# Altium project PCB_Project_IGNIS_v2.PrjPcb
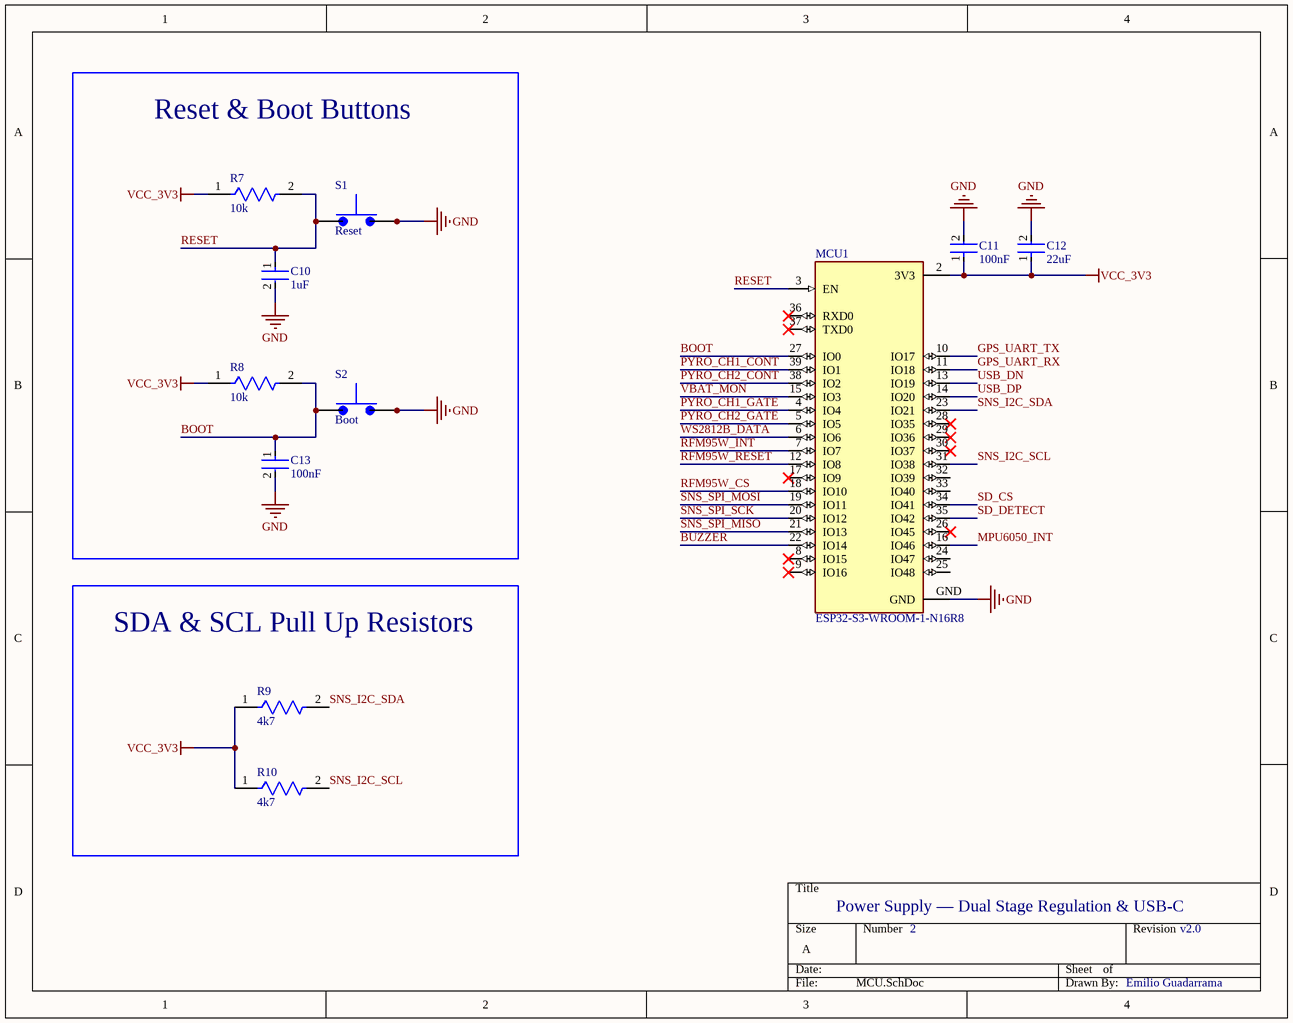
[diagram p0: MCU.SchDoc]
8 sheets, 58 parts. Net scope: flat (ports and power ports of the same name join across sheets).
Sheets:
  Main.SchDoc
  MCU.SchDoc
  Power.SchDoc
  RF_LoRa_&_GPS.SchDoc
  Sensors.SchDoc
  Storage.SchDoc
  Indicators.SchDoc
  Pyros.SchDoc

## Sheet Main.SchDoc
size A; SheetNumber: 1; SheetTotal: 8

## Sheet MCU.SchDoc
size A; SheetNumber: 2; SheetTotal: 8

### Parts
C10  1uF  [FP-C0805C-DN-MFG]
C11  100nF  [FP-C0805C-DN-MFG]
C12  22uF  [FP-C0805C-DN-MFG]
C13  100nF  [FP-C0805C-DN-MFG]
MCU1  ESP32-S3-WROOM-1-N16R8  [XCVR_ESP32-S3-WROOM-1-N16R2]
R7  10k  [FP-MCT0603-IPC_A]
R8  10k  [FP-MCT0603-IPC_A]
R9  4k7  [FP-MCT0603-IPC_A]
R10  4k7  [FP-MCT0603-IPC_A]
S1  Reset  [SW_SKRPABE010]
S2  Boot  [SW_SKRPABE010]

### Blocks framed on the sheet
Reset & Boot Buttons: C10 C13 R7 R8 S1 S2
SDA & SCL Pull Up Resistors: R9 R10

### Nets
GND: C10.2 C11.2 C12.2 C13.2 MCU1.GND S1.3 S1.4 S2.3 S2.4
VCC_3V3: C11.1 C12.1 MCU1.2(3V3) R7.1 R8.1 R9.1 R10.1
BOOT: C13.1 MCU1.27(IO0) R8.2 S2.1 S2.2
BUZZER: MCU1.22(IO14)
GPS_UART_RX: MCU1.11(IO18)
GPS_UART_TX: MCU1.10(IO17)
MPU6050_INT: MCU1.16(IO46)
PYRO_CH1_CONT: MCU1.39(IO1)
PYRO_CH1_GATE: MCU1.4(IO4)
PYRO_CH2_CONT: MCU1.38(IO2)
PYRO_CH2_GATE: MCU1.5(IO5)
RESET: C10.1 MCU1.3(EN) R7.2 S1.1 S1.2
RFM95W_CS: MCU1.18(IO10)
RFM95W_INT: MCU1.7(IO7)
RFM95W_RESET: MCU1.12(IO8)
SD_CS: MCU1.34(IO41)
SD_DETECT: MCU1.35(IO42)
SNS_I2C_SCL: MCU1.31(IO38) R10.2
SNS_I2C_SDA: MCU1.23(IO21) R9.2
SNS_SPI_MISO: MCU1.21(IO13)
SNS_SPI_MOSI: MCU1.19(IO11)
SNS_SPI_SCK: MCU1.20(IO12)
USB_DN: MCU1.13(IO19)
USB_DP: MCU1.14(IO20)
VBAT_MON: MCU1.15(IO3)
WS2812B_DATA: MCU1.6(IO6)

Not connected (* = marked no-connect by the designer): MCU1 8(IO15)* 9(IO16)* 17(IO9)* 24(IO47) 25(IO48) 26(IO45)* 28(IO35)* 29(IO36)* 30(IO37)* 32(IO39) 33(IO40) 36(RXD0)* 37(TXD0)*

### Notes on the sheet
- Power Supply — Dual Stage Regulation & USB-C
- 2
- v2.0
- Emilio Guadarrama

### Library data of the parts
C10-C13 = CMP-2007-00279-2: CAP CER 0.1UF 50V X7R 0805; Manufacturer Part Number: C0805C104K5RACTU; Manufacturer: KEMET; Value: 0.10 μF; Tolerance: 0.1; Temperature Coefficient: 30ppm/°C; Material: Ceramic; Device Class L2: Capacitors; Temperature Range Low: -55°C; Voltage Rating: 50 V; Digikey Description: CAP CER 0.1UF 50V X7R 0805; Category: Cap; ComponentLink2Description: Datasheet; Octopart: https://octopart.com/c0805c104k5ractu-kemet-143926; RoHS: TRUE; ComponentLink2URL: https://content.kemet.com/datasheets/KEM_C1003_C0G_SMD.pdf; Temperature Characteristic: X7R; Temperature: -55°C to +125°C; Height: 0.88mm; Temperature Range High: +125°C; Device Class L1: Passive Components; Automotive: No; Lead Free: Yes; Ipc Land Pattern Name: CAPC200125X78; Device Class L3: Ceramic Capacitors; Mouser Description: Cap Ceramic 0.1uF 50V X7R 10% SMD 2.0 x 1.2 mm 125 C Paper T/R; Capacitance: 0.10 μF; Package: C0805C-DN
MCU1 = ESP32-S3-WROOM-1-N16R2: Bluetooth, WiFi 802.11b/g/n, Bluetooth v5.0 Transceiver Module 2.4GHz PCB Trace Surface Mount; MF: Espressif Systems; MP: ESP32S3WROOM1N16R2; SnapEDA_Link: https://www.snapeda.com/parts/ESP32S3WROOM1N16R2/Espressif+Systems/view-part/?ref=snap; Package: NON STANDARD Espressif Systems; Value: *; Check_prices: https://www.snapeda.com/parts/ESP32S3WROOM1N16R2/Espressif+Systems/view-part/?ref=eda
R7-R10 = CMP-02407-011165-1: RES SMD 100 OHM 1% 1/8W 0603; Temperature Coefficient: 25ppm/°C; Resistance: 20kR; Power Rating: 125mW; Tolerance: 0.1%; Voltage Rating: 75V; Length: 1.55mm; Case Code (Imperial): 0603; Case/Package: 0603; Construction: Rectangular; Package Quantity: 1000; Number of Terminations: 2; Termination: SMD/SMT; Resistor Type: Thin Film; Features: Automotive AEC-Q200; Series: MCT 0603 - Precision; Max Operating Temperature: 155°C; Depth: 0.85mm; Max Power Dissipation: 125mW; Min Operating Temperature: -55°C; Width: 0.033inch; Case Code (Metric): 1608; Packaging: Tape and Reel; Weight: 6.7E-05oz; Military Standard: Not; Height: 0.022inch
S1 S2 = SKRPABE010: Switch Tactile N.O. SPST Button J-Bend 0.05A 16VDC 1.57N SMD Automotive T/R; MF: ALPS; SnapEDA_Link: https://www.snapeda.com/parts/SKRPABE010/ALPS/view-part/?ref=snap; Package: None; Value: *; MP: SKRPABE010; Check_prices: https://www.snapeda.com/parts/SKRPABE010/ALPS/view-part/?ref=eda

## Sheet Power.SchDoc
size A; SheetNumber: 3; SheetTotal: 8
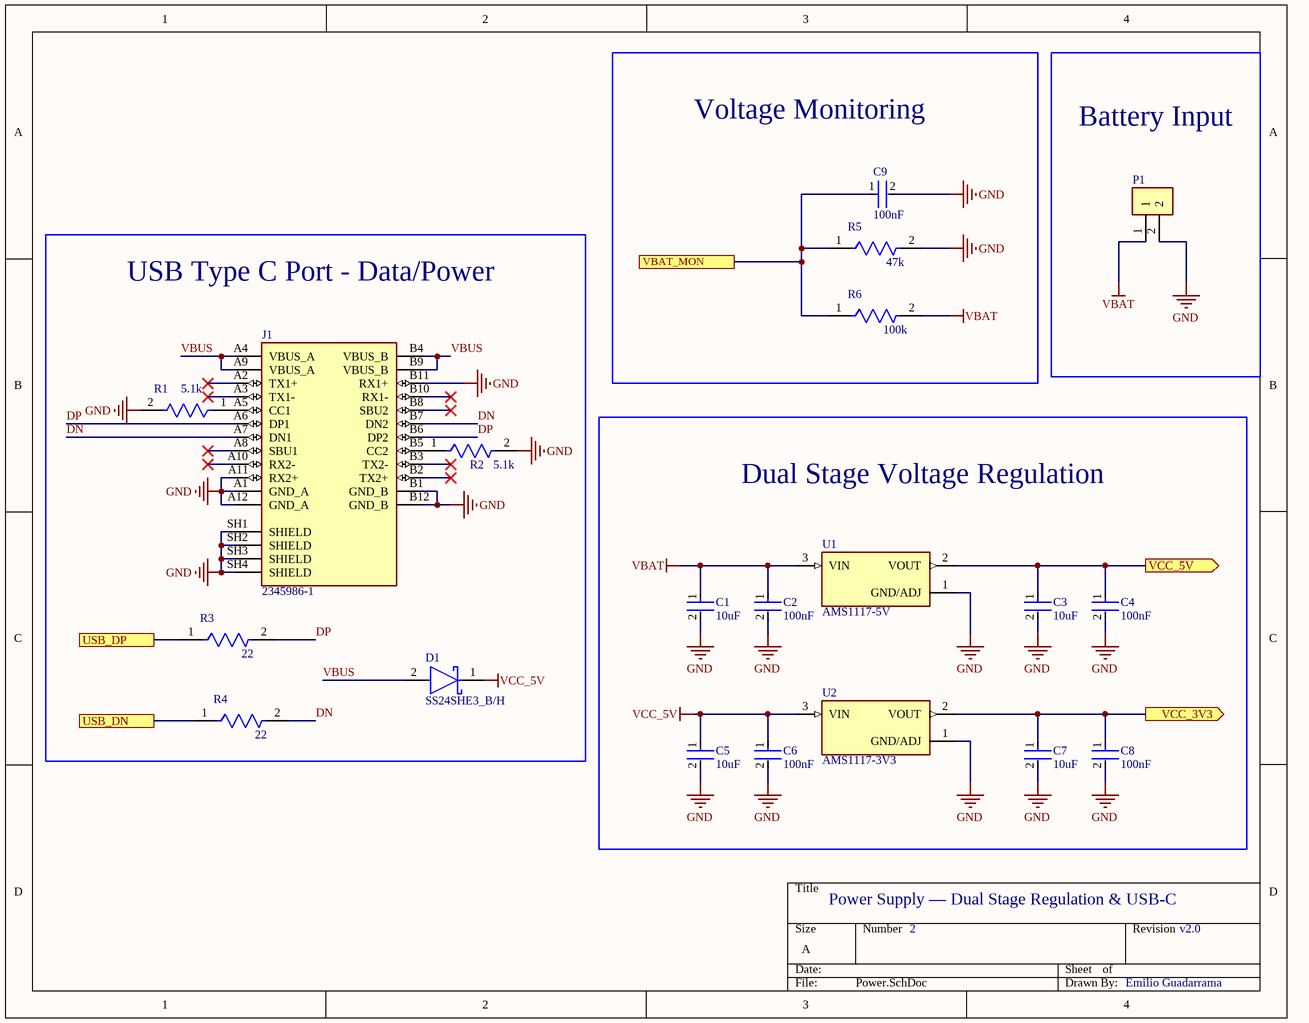
[diagram p1: Power.SchDoc]

### Parts
C1  10uF  [FP-C0805C-DN-MFG]
C2  100nF  [FP-C0805C-DN-MFG]
C3  10uF  [FP-C0805C-DN-MFG]
C4  100nF  [FP-C0805C-DN-MFG]
C5  10uF  [FP-C0805C-DN-MFG]
C6  100nF  [FP-C0805C-DN-MFG]
C7  10uF  [FP-C0805C-DN-MFG]
C8  100nF  [FP-C0805C-DN-MFG]
C9  100nF  [FP-C0805C-DN-MFG]
D1  SS24SHE3_B/H  [FP-95400-MFG]
J1  2345986-1  [TE_2345986-1]
P1  282837-2  [TE_282837-2]  (value not drawn)
R1  5.1k  [FP-MCT0603-IPC_A]
R2  5.1k  [FP-MCT0603-IPC_A]
R3  22  [FP-MCT0603-IPC_A]
R4  22  [FP-MCT0603-IPC_A]
R5  47k  [FP-MCT0603-IPC_A]
R6  100k  [FP-MCT0603-IPC_A]
U1  AMS1117-5V  [SOT229P700X180-4N]
U2  AMS1117-3V3  [SOT229P700X180-4N]

### Blocks framed on the sheet
Voltage Monitoring: C9 R5 R6
Battery Input: P1
Dual Stage Voltage Regulation: C1-C8 U1 U2

### Ports
USB_DN, USB_DP, VBAT_MON, VCC_3V3 (out), VCC_5V (out)

### Nets
GND: C1.2 C2.2 C3.2 C4.2 C5.2 C6.2 C7.2 C8.2 C9.2 J1.A1(GND_A) J1.A11(RX2+) J1.A12(GND_A) J1.B1(GND_B) J1.B11(RX1+) J1.B12(GND_B) J1.SH1(SHIELD) J1.SH2(SHIELD) J1.SH3(SHIELD) J1.SH4(SHIELD) P1.2 R1.2 R2.2 R5.2 U1.1(GND/ADJ) U2.1(GND/ADJ)
VBAT: C1.1 C2.1 P1.1 R6.2 U1.3(VIN)
VCC_5V: C5.1 C6.1 D1.1(C) U2.3(VIN)
DN: J1.A7(DN1) J1.B7(DN2) R4.2
DP: J1.A6(DP1) J1.B6(DP2) R3.2
VBUS: D1.2(A) J1.A4(VBUS_A) J1.A9(VBUS_A) J1.B4(VBUS_B) J1.B9(VBUS_B)
NetC3_1: C3.1 C4.1 U1.2(VOUT) ; port VCC_5V
NetC7_1: C7.1 C8.1 U2.2(VOUT) ; port VCC_3V3
NetC9_1: C9.1 R5.1 R6.1 ; port VBAT_MON
NetJ1_A5: J1.A5(CC1) R1.1
NetJ1_B5: J1.B5(CC2) R2.1
NetR3_1: R3.1 ; port USB_DP
NetR4_1: R4.1 ; port USB_DN

Not connected (* = marked no-connect by the designer): J1 A2(TX1+)* A3(TX1-)* A8(SBU1)* A10(RX2-)* B2(TX2+)* B3(TX2-)* B8(SBU2)* B10(RX1-)*

### Notes on the sheet
- USB Type C Port - Data/Power
- Power Supply — Dual Stage Regulation & USB-C
- 2
- v2.0
- Emilio Guadarrama

### Library data of the parts
C1-C9 = CMP-2007-00279-2: as C10 on sheet MCU; Device Class L2: Capacitors; Temperature Range Low: -55°C; Voltage Rating: 50 V; Digikey Description: CAP CER 0.1UF 50V X7R 0805; Category: Cap; ComponentLink2Description: Datasheet; Octopart: https://octopart.com/c0805c104k5ractu-kemet-143926; RoHS: TRUE; ComponentLink2URL: https://content.kemet.com/datasheets/KEM_C1003_C0G_SMD.pdf; Temperature Characteristic: X7R; Temperature: -55°C to +125°C; Height: 0.88mm; Temperature Range High: +125°C; Device Class L1: Passive Components; Automotive: No; Lead Free: Yes; Ipc Land Pattern Name: CAPC200125X78; Device Class L3: Ceramic Capacitors; Mouser Description: Cap Ceramic 0.1uF 50V X7R 10% SMD 2.0 x 1.2 mm 125 C Paper T/R; Capacitance: 0.10 μF; Package: C0805C-DN
D1 = CMP-02539-000047-1: DIODE SCHOTTKY 2A 40V DO-214AC; RoHS Compliant: Yes
P1 = 282837-2: Ð Ð°Ð·ÑŠÐµÐ¼Ð½Ñ‹Ðµ ÐºÐ»ÐµÐ¼Ð¼Ð½Ñ‹Ðµ ÐºÐ¾Ð»Ð¾Ð´ÐºÐ¸ Ð Ð¾Ð·ÐµÑ‚ÐºÐ° 2 Ð¿Ð¾Ð»Ð¾Ð¶ÐµÐ½Ð¸Ñ 5,08 Ð¼Ð¼ ÐŸÑ€Ð¸Ð¿Ð¾Ð¹ Ð¿Ñ€ÑÐ¼Ð¾Ð¹ Ñ‡ÐµÑ€ÐµÐ· Ð¾Ñ‚Ð²ÐµÑ€ÑÑ‚Ð¸Ðµ 13,5 Ð / ÐºÐ¾Ð½Ñ‚Ð°ÐºÑ‚; MF: TE Connectivity; SnapEDA_Link: https://www.snapeda.com/parts/282837-2/TE+Connectivity+AMP+Connectors/view-part/?ref=snap; Price: None; Check_prices: https://www.snapeda.com/parts/282837-2/TE+Connectivity+AMP+Connectors/view-part/?ref=eda; Purchase-URL: https://pricing.snapeda.com/search/part/282837-2/?ref=eda; MP: 282837-2; Value: *; Availability: In Stock; Package: None
R1-R6 = CMP-02407-011165-1: as R7 on sheet MCU; Length: 1.55mm; Case Code (Imperial): 0603; Case/Package: 0603; Construction: Rectangular; Package Quantity: 1000; Number of Terminations: 2; Termination: SMD/SMT; Resistor Type: Thin Film; Features: Automotive AEC-Q200; Series: MCT 0603 - Precision; Max Operating Temperature: 155°C; Depth: 0.85mm; Max Power Dissipation: 125mW; Min Operating Temperature: -55°C; Width: 0.033inch; Case Code (Metric): 1608; Packaging: Tape and Reel; Weight: 6.7E-05oz; Military Standard: Not; Height: 0.022inch
U1 U2 = AMS1117-5.0: 1A LOW DROPOUT VOLTAGE REGULATOR; MF: ams; MP: AMS1117-5.0; Package: SOT-223 Seeed Technology; SnapEDA_Link: https://www.snapeda.com/parts/AMS1117-5.0/ams/view-part/?ref=snap; Check_prices: https://www.snapeda.com/parts/AMS1117-5.0/ams/view-part/?ref=eda; Availability: Not in stock; Value: *; Price: None
J1 = 2345986-1: Package: None; Price: None; Value: *; MP: 2345986-1; Availability: Unavailable

## Sheet RF_LoRa_&_GPS.SchDoc
size A; SheetNumber: 4; SheetTotal: 8
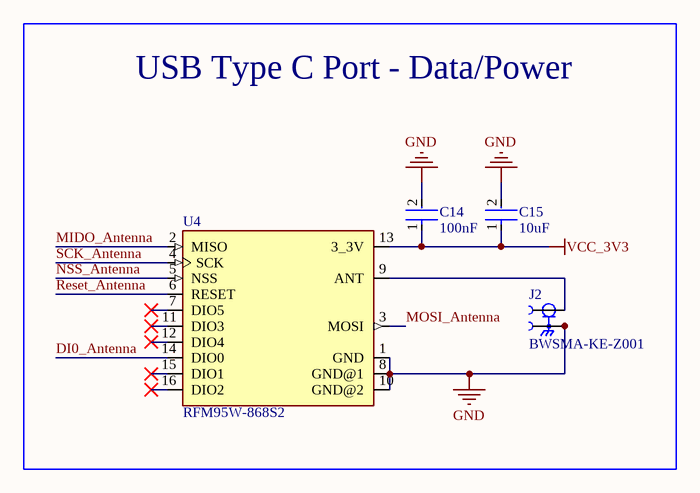
[diagram p2: RF_LoRa_&_GPS.SchDoc]

### Parts
C14  100nF  [FP-C0805C-DN-MFG]
C15  10uF  [FP-C0805C-DN-MFG]
J2  BWSMA-KE-Z001  [BAT_WIRELESS_BWSMA-KE-Z001]
U4  RFM95W-868S2  [XCVR_RFM95W-868S2]

### Nets
GND: C14.2 C15.2 J2.2_1 J2.2_2 J2.2_3 J2.2_4 U4.1(GND) U4.8(GND@1) U4.10(GND@2)
VCC_3V3: C14.1 C15.1 U4.13(3_3V)
DI0_Antenna: U4.14(DIO0)
MIDO_Antenna: U4.2(MISO)
MOSI_Antenna: U4.3(MOSI)
NSS_Antenna: U4.5(NSS)
Reset_Antenna: U4.6(RESET)
SCK_Antenna: U4.4(SCK)
NetJ2_1: J2.1 U4.9(ANT)

Not connected (* = marked no-connect by the designer): U4 7(DIO5)* 11(DIO3)* 12(DIO4)* 15(DIO1)* 16(DIO2)*

### Notes on the sheet
- USB Type C Port - Data/Power

### Library data of the parts
C14 C15 = CMP-2007-00279-2: as C10 on sheet MCU; Device Class L2: Capacitors; Temperature Range Low: -55°C; Voltage Rating: 50 V; Digikey Description: CAP CER 0.1UF 50V X7R 0805; Category: Cap; ComponentLink2Description: Datasheet; Octopart: https://octopart.com/c0805c104k5ractu-kemet-143926; RoHS: TRUE; ComponentLink2URL: https://content.kemet.com/datasheets/KEM_C1003_C0G_SMD.pdf; Temperature Characteristic: X7R; Temperature: -55°C to +125°C; Height: 0.88mm; Temperature Range High: +125°C; Device Class L1: Passive Components; Automotive: No; Lead Free: Yes; Ipc Land Pattern Name: CAPC200125X78; Device Class L3: Ceramic Capacitors; Mouser Description: Cap Ceramic 0.1uF 50V X7R 10% SMD 2.0 x 1.2 mm 125 C Paper T/R; Capacitance: 0.10 μF; Package: C0805C-DN
J2 = BWSMA-KE-Z001: 1 Inner bore SMA Board Edge Positive foot -65â„ƒ~+165â„ƒ 50Î© Plugin RF Connectors / Coaxial Connectors ROHS; MF: Bat Wireless; SnapEDA_Link: https://www.snapeda.com/parts/BWSMA-KE-Z001/Bat+Wireless/view-part/?ref=snap; Package: None; Value: *; MP: BWSMA-KE-Z001; Check_prices: https://www.snapeda.com/parts/BWSMA-KE-Z001/Bat+Wireless/view-part/?ref=eda
U4 = RFM95W-868S2: General ISM < 1GHz LoRaâ„¢ Transceiver Module 868MHz Antenna Not Included Surface Mount; MF: RF; Package: Non Standard RF Solutions; Price: None; Check_prices: https://www.snapeda.com/parts/RFM95W-868S2/RF+Solutions/view-part/?ref=eda; Value: *; SnapEDA_Link: https://www.snapeda.com/parts/RFM95W-868S2/RF+Solutions/view-part/?ref=snap; MP: RFM95W-868S2; Availability: In Stock; Purchase-URL: https://pricing.snapeda.com/search?q=RFM95W-868S2&ref=eda

## Sheet Sensors.SchDoc
size A; SheetNumber: 5; SheetTotal: 9
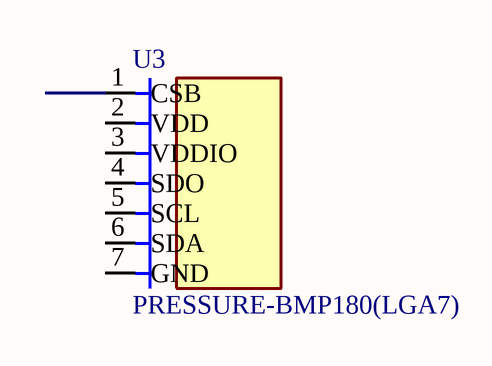
[diagram p3: Sensors.SchDoc]

### Parts
U3  PRESSURE-BMP180(LGA7)  [LGA7-1.5-3.8X3.6MM]

### Nets

Not connected (* = marked no-connect by the designer): U3 1(CSB) 2(VDD) 3(VDDIO) 4(SDO) 5(SCL) 6(SDA) 7(GND)

### Library data of the parts
U3 = PRESSURE-BMP180(LGA7): Pressure Sensor 4.35PSI ~ 15.95PSI (30kPa ~ 110kPa) Absolute - 16 ~ 19 b 7-VLGA; MF: Bosch; MP: BMP180; SnapEDA_Link: https://www.snapeda.com/parts/BMP180/Bosch/view-part/?ref=snap; Package: LGA-7 Bosch; Value: *; Check_prices: https://www.snapeda.com/parts/BMP180/Bosch/view-part/?ref=eda

## Sheet Storage.SchDoc
size A; SheetNumber: 6; SheetTotal: 6

## Sheet Indicators.SchDoc
size A; SheetNumber: 7; SheetTotal: 7

## Sheet Pyros.SchDoc
size A; SheetNumber: 8; SheetTotal: 8
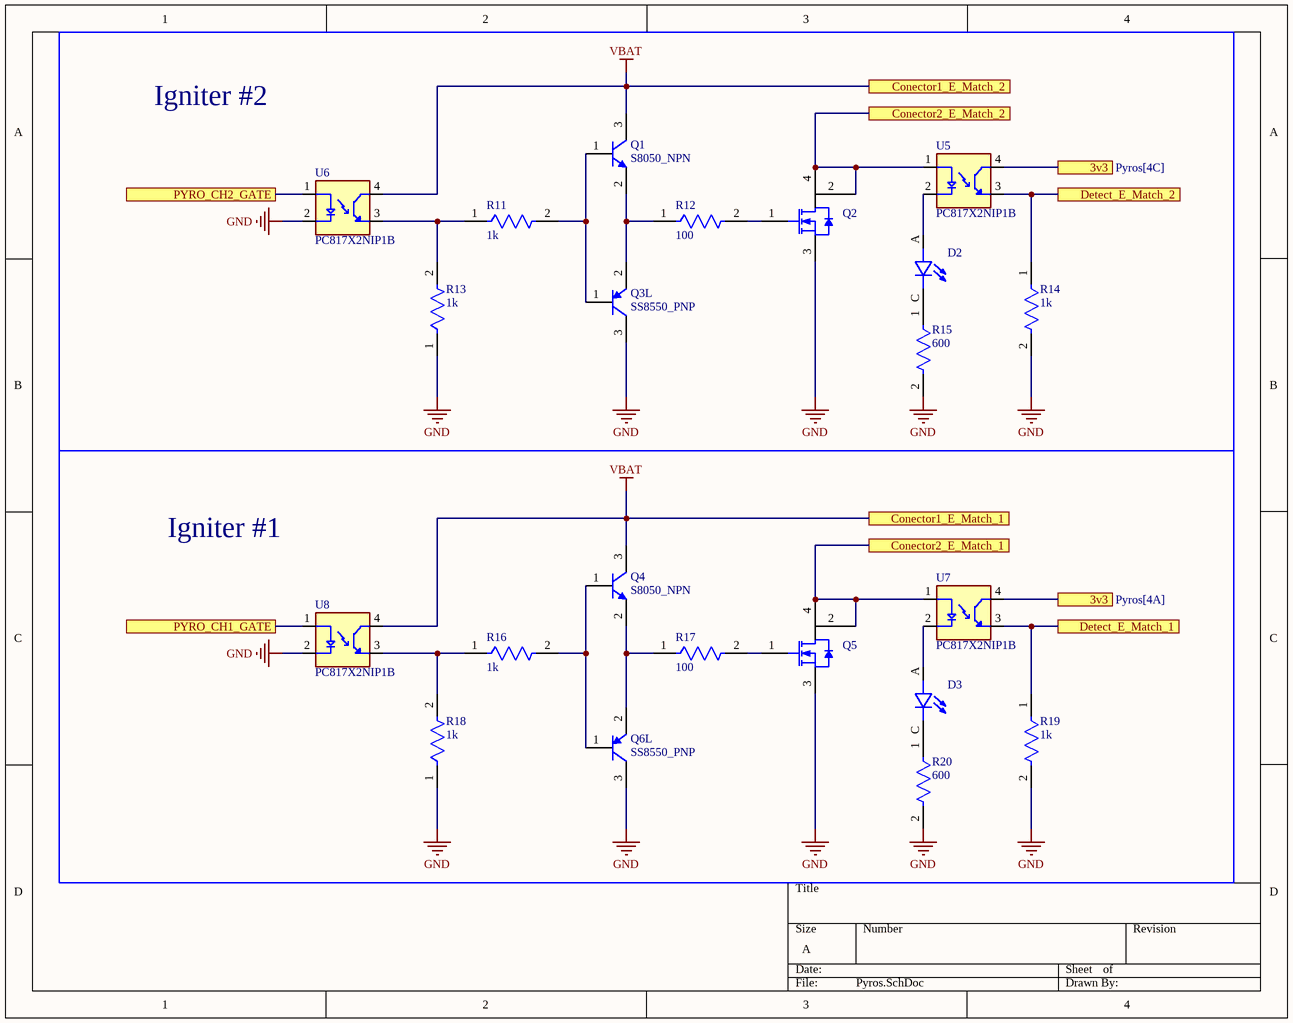
[diagram p4: Pyros.SchDoc]

### Parts
D2  SML-LXT0805IW-TR  [LEDC2012X120N]  (value not drawn)
D3  SML-LXT0805IW-TR  [LEDC2012X120N]  (value not drawn)
Q1  S8050_NPN  [PCBComponent_1]
Q2  NCE6005AR_Mosfet_N  [PCBComponent_1]  (value not drawn)
Q3  SS8550_PNP  [PCBComponent_1]  (part L of 12)
Q4  S8050_NPN  [PCBComponent_1]
Q5  NCE6005AR_Mosfet_N  [PCBComponent_1]  (value not drawn)
Q6  SS8550_PNP  [PCBComponent_1]  (part L of 12)
R11  1k  [FP-MCT0603-IPC_A]
R12  100  [FP-MCT0603-IPC_A]
R13  1k  [FP-MCT0603-IPC_A]
R14  1k  [FP-MCT0603-IPC_A]
R15  600  [FP-MCT0603-IPC_A]
R16  1k  [FP-MCT0603-IPC_A]
R17  100  [FP-MCT0603-IPC_A]
R18  1k  [FP-MCT0603-IPC_A]
R19  1k  [FP-MCT0603-IPC_A]
R20  600  [FP-MCT0603-IPC_A]
U5  PC817X2NIP1B  [SOIC254P960X420-4N]
U6  PC817X2NIP1B  [SOIC254P960X420-4N]
U7  PC817X2NIP1B  [SOIC254P960X420-4N]
U8  PC817X2NIP1B  [SOIC254P960X420-4N]

### Blocks framed on the sheet
Igniter #2: D2 Q1-Q3 R11-R15 U5 U6
Igniter #1: D3 Q4-Q6 R16-R20 U7 U8

### Ports
3v3 (see Pyros[4A]), 3v3 (see Pyros[4C]), Conector1_E_Match_1, Conector1_E_Match_2, Conector2_E_Match_1, Conector2_E_Match_2, Detect_E_Match_1, Detect_E_Match_2, PYRO_CH1_GATE, PYRO_CH2_GATE

### Nets
GND: Q2.3(S) Q3.3(C) Q5.3(S) Q6.3(C) R13.1 R14.2 R15.2 R18.1 R19.2 R20.2 U6.2(C) U8.2(C)
VBAT: Q1.3(C) Q4.3(C) U6.4(CT) U8.4(CT) ; port Conector1_E_Match_1, port Conector1_E_Match_2
NetD2_A: D2.A U5.2(C)
NetD2_C: D2.C R15.1
NetD3_A: D3.A U7.2(C)
NetD3_C: D3.C R20.1
NetQ1_1: Q1.1(B) Q3.1(B) R11.2
NetQ1_2: Q1.2(E) Q3.2(E) R12.1
NetQ2_1: Q2.1(G) R12.2
NetQ2_2: Q2.2(D) Q2.4(D) U5.1(A) ; port Conector2_E_Match_2
NetQ4_1: Q4.1(B) Q6.1(B) R16.2
NetQ4_2: Q4.2(E) Q6.2(E) R17.1
NetQ5_1: Q5.1(G) R17.2
NetQ5_2: Q5.2(D) Q5.4(D) U7.1(A) ; port Conector2_E_Match_1
NetR11_1: R11.1 R13.2 U6.3(ET)
NetR14_1: R14.1 U5.3(ET) ; port Detect_E_Match_2
NetR16_1: R16.1 R18.2 U8.3(ET)
NetR19_1: R19.1 U7.3(ET) ; port Detect_E_Match_1
NetU5_4: U5.4(CT) U7.4(CT) ; port 3v3
NetU6_1: U6.1(A) ; port PYRO_CH2_GATE
NetU8_1: U8.1(A) ; port PYRO_CH1_GATE

### Library data of the parts
D2 D3 = SML-LXT0805IW-TR: LED;Red;11mcd;0.061In.Dia.;SMD;100mA;2V Vf;635nm;140deg;SMD;White Diffused;5V Vr | Lumex SML-LXT0805IW-TR; MF: Lumex Opto/Components; SnapEDA_Link: https://www.snapeda.com/parts/SML-LXT0805IW-TR/Lumex+Opto%252FComponents+Inc./view-part/?ref=snap; Package: 0805 Lumex; Value: *; MP: SML-LXT0805IW-TR; Check_prices: https://www.snapeda.com/parts/SML-LXT0805IW-TR/Lumex+Opto%252FComponents+Inc./view-part/?ref=eda
Q1 Q3 Q4 Q6 = Component_1
Q2 Q5 = NCE6005AR
R11-R20 = CMP-02407-011165-1: as R7 on sheet MCU; Length: 1.55mm; Case Code (Imperial): 0603; Case/Package: 0603; Construction: Rectangular; Package Quantity: 1000; Number of Terminations: 2; Termination: SMD/SMT; Resistor Type: Thin Film; Features: Automotive AEC-Q200; Series: MCT 0603 - Precision; Max Operating Temperature: 155°C; Depth: 0.85mm; Max Power Dissipation: 125mW; Min Operating Temperature: -55°C; Width: 0.033inch; Case Code (Metric): 1608; Packaging: Tape and Reel; Weight: 6.7E-05oz; Military Standard: Not; Height: 0.022inch
U5-U8 = PC817X2NIP1B: Optocoupler DC-IN 1-CH Transistor DC-OUT 4-Pin DIP SMD T/R; MF: Sharp Microelectronics; SnapEDA_Link: https://www.snapeda.com/parts/PC817X2NIP1B/Sharp+Microelectronics/view-part/?ref=snap; Package: SMD-4 Sharp Microelectronics; Value: *; MP: PC817X2NIP1B; Check_prices: https://www.snapeda.com/parts/PC817X2NIP1B/Sharp+Microelectronics/view-part/?ref=eda

## Nets that join several sheets
GND: MCU (9 pins), Power (25 pins), RF_LoRa_&_GPS (9 pins), Pyros (12 pins)
VBAT: Power (5 pins), Pyros (Q1.3 Q4.3 U6.4 U8.4)
VCC_3V3: MCU (7 pins), RF_LoRa_&_GPS (C14.1 C15.1 U4.13)